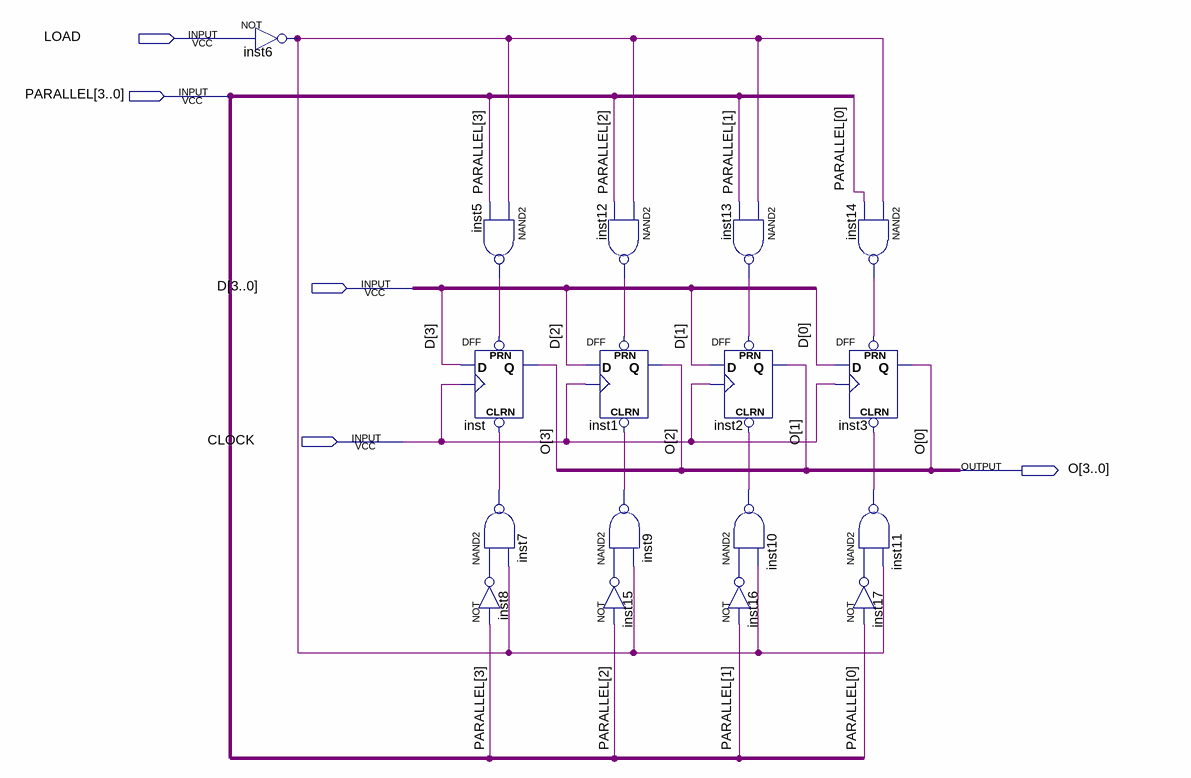
[diagram p0: schematic sheet]
// Quartus schematic Register_1bit.bdf as structural Verilog: 17 symbols, 5 pins
module Register_1bit (
  input  LOAD,
  input  [3:0] PARALLEL,
  input  [3:0] D,
  input  CLOCK,
  output [3:0] O
);

  wire inst5_out, inst6_out, inst7_out, inst8_out, inst9_out, inst10_out, inst11_out, inst12_out, inst13_out,
       inst14_out, inst15_out, inst16_out, inst17_out;

  not inst6 (inst6_out, LOAD);
  nand inst5 (inst5_out, inst6_out, PARALLEL[3]);
  DFF inst (.CLRN(inst7_out), .CLK(CLOCK), .D(D[3]), .PRN(inst5_out), .Q(O[3]));
  nand inst7 (inst7_out, inst8_out, inst6_out);
  not inst8 (inst8_out, PARALLEL[3]);
  DFF inst1 (.CLRN(inst9_out), .CLK(CLOCK), .D(D[2]), .PRN(inst12_out), .Q(O[2]));
  nand inst12 (inst12_out, inst6_out, PARALLEL[2]);
  nand inst9 (inst9_out, inst15_out, inst6_out);
  not inst15 (inst15_out, PARALLEL[2]);
  nand inst13 (inst13_out, inst6_out, PARALLEL[1]);
  DFF inst2 (.CLRN(inst10_out), .CLK(CLOCK), .D(D[1]), .PRN(inst13_out), .Q(O[1]));
  nand inst10 (inst10_out, inst16_out, inst6_out);
  not inst16 (inst16_out, PARALLEL[1]);
  nand inst14 (inst14_out, inst6_out, PARALLEL[0]);
  DFF inst3 (.CLRN(inst11_out), .CLK(CLOCK), .D(D[0]), .PRN(inst14_out), .Q(O[0]));
  nand inst11 (inst11_out, inst17_out, inst6_out);
  not inst17 (inst17_out, PARALLEL[0]);
endmodule
